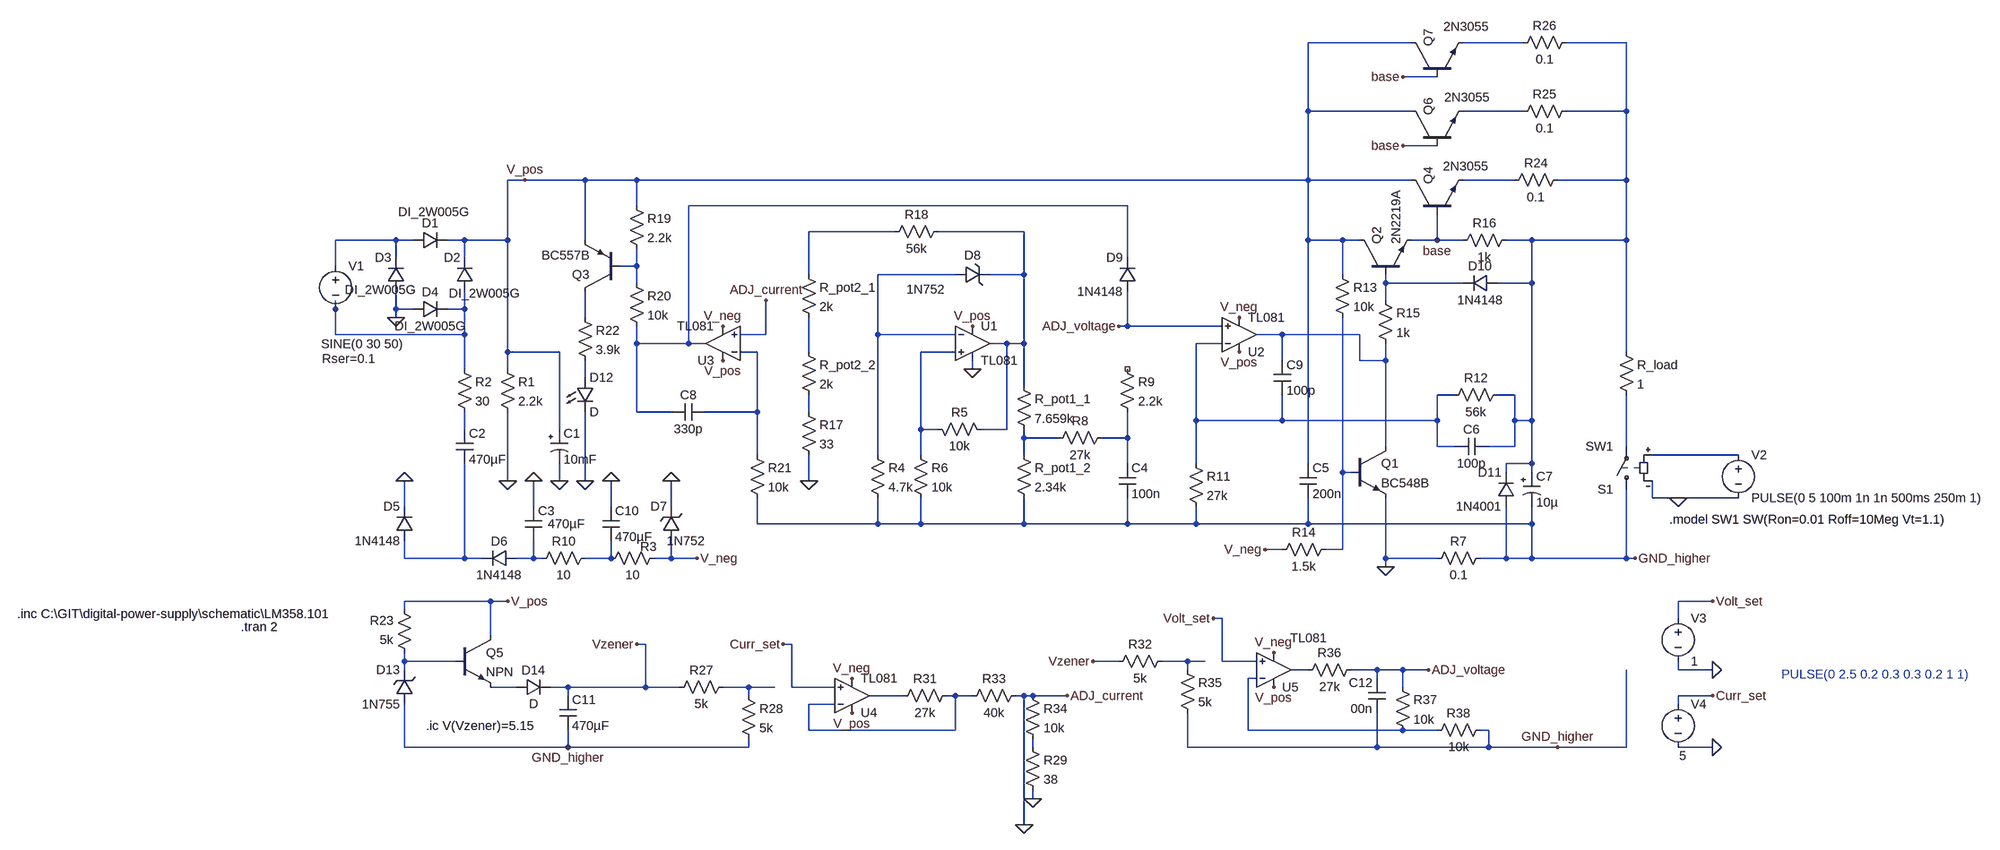
[diagram p0: schematic cccv_psu_v2.asc]
cccv_psu_v2.asc, the LTspice schematic file:
Version 4
SHEET 1 3300 1276
WIRE 2016 -256 1824 -256
WIRE 2224 -256 2112 -256
WIRE 2416 -256 2304 -256
WIRE 2064 -192 2000 -192
WIRE 1824 -128 1824 -256
WIRE 2016 -128 1824 -128
WIRE 2224 -128 2112 -128
WIRE 2416 -128 2416 -256
WIRE 2416 -128 2304 -128
WIRE 2064 -64 2000 -64
WIRE 368 0 336 0
WIRE 480 0 368 0
WIRE 576 0 480 0
WIRE 1824 0 1824 -128
WIRE 1824 0 576 0
WIRE 2016 0 1824 0
WIRE 2208 0 2112 0
WIRE 2416 0 2416 -128
WIRE 2416 0 2288 0
WIRE 576 48 576 0
WIRE 1488 48 672 48
WIRE 1056 96 896 96
WIRE 1296 96 1136 96
WIRE 128 112 16 112
WIRE 160 112 128 112
WIRE 256 112 224 112
WIRE 336 112 336 0
WIRE 336 112 256 112
WIRE 480 112 480 0
WIRE 1824 112 1824 0
WIRE 1888 112 1824 112
WIRE 1920 112 1888 112
WIRE 2064 112 2064 64
WIRE 2064 112 2016 112
WIRE 2112 112 2064 112
WIRE 2240 112 2192 112
WIRE 2416 112 2416 0
WIRE 2416 112 2240 112
WIRE 128 144 128 112
WIRE 256 144 256 112
WIRE 1488 144 1488 48
WIRE 16 160 16 112
WIRE 576 160 576 128
WIRE 576 160 544 160
WIRE 896 176 896 96
WIRE 1168 176 1024 176
WIRE 1296 176 1296 96
WIRE 1296 176 1232 176
WIRE 1888 176 1888 112
WIRE 576 192 576 160
WIRE 1968 192 1968 176
WIRE 2112 192 1968 192
WIRE 2240 192 2240 112
WIRE 2240 192 2176 192
WIRE 1968 224 1968 192
WIRE 16 240 16 224
WIRE 128 240 128 208
WIRE 160 240 128 240
WIRE 256 240 256 208
WIRE 256 240 224 240
WIRE 128 256 128 240
WIRE 480 256 480 208
WIRE 1488 272 1488 208
WIRE 1488 272 1472 272
WIRE 1664 272 1488 272
WIRE 16 288 16 240
WIRE 256 288 256 240
WIRE 256 288 16 288
WIRE 816 288 816 224
WIRE 816 288 768 288
WIRE 1024 288 1024 176
WIRE 1168 288 1024 288
WIRE 1776 288 1728 288
WIRE 1920 288 1776 288
WIRE 576 304 576 272
WIRE 672 304 672 48
WIRE 672 304 576 304
WIRE 704 304 672 304
WIRE 1264 304 1232 304
WIRE 1296 304 1296 176
WIRE 1296 304 1264 304
WIRE 1664 304 1616 304
WIRE 336 320 336 112
WIRE 432 320 336 320
WIRE 800 320 768 320
WIRE 896 320 896 256
WIRE 1168 320 1104 320
WIRE 2416 320 2416 112
WIRE 1776 336 1776 288
WIRE 1920 336 1920 288
WIRE 1968 336 1968 304
WIRE 1968 336 1920 336
WIRE 256 352 256 288
WIRE 336 352 336 320
WIRE 1200 352 1200 336
WIRE 480 368 480 336
WIRE 1296 384 1296 304
WIRE 2096 400 2064 400
WIRE 2208 400 2176 400
WIRE 576 432 576 304
WIRE 640 432 576 432
WIRE 800 432 800 320
WIRE 800 432 704 432
WIRE 896 432 896 400
WIRE 1616 448 1616 304
WIRE 1776 448 1776 400
WIRE 1776 448 1616 448
WIRE 2064 448 2064 400
WIRE 2064 448 1776 448
WIRE 2208 448 2208 400
WIRE 2240 448 2240 192
WIRE 2240 448 2208 448
WIRE 256 464 256 432
WIRE 432 464 432 320
WIRE 1104 464 1104 320
WIRE 1136 464 1104 464
WIRE 1264 464 1264 304
WIRE 1264 464 1216 464
WIRE 1296 480 1296 464
WIRE 1360 480 1296 480
WIRE 1488 480 1488 432
WIRE 1488 480 1440 480
WIRE 1968 496 1968 336
WIRE 2064 496 2064 448
WIRE 2096 496 2064 496
WIRE 2208 496 2208 448
WIRE 2208 496 2160 496
WIRE 2416 496 2416 400
WIRE 800 512 800 432
WIRE 1024 512 1024 288
WIRE 1104 512 1104 464
WIRE 1296 512 1296 480
WIRE 2624 512 2464 512
WIRE 1488 528 1488 480
WIRE 1616 528 1616 448
WIRE 1824 528 1824 112
WIRE 2240 528 2240 448
WIRE 2240 528 2192 528
WIRE 1888 544 1888 256
WIRE 1904 544 1888 544
WIRE 2192 544 2192 528
WIRE 2240 544 2240 528
WIRE 336 560 336 432
WIRE 432 560 432 528
WIRE 480 560 480 432
WIRE 896 560 896 512
WIRE 2464 592 2464 560
WIRE 2512 592 2464 592
WIRE 2624 592 2512 592
WIRE 144 608 144 560
WIRE 384 608 384 560
WIRE 528 608 528 560
WIRE 640 608 640 560
WIRE 800 640 800 592
WIRE 1024 640 1024 592
WIRE 1024 640 800 640
WIRE 1104 640 1104 592
WIRE 1104 640 1024 640
WIRE 1296 640 1296 592
WIRE 1296 640 1104 640
WIRE 1488 640 1488 592
WIRE 1488 640 1296 640
WIRE 1616 640 1616 608
WIRE 1616 640 1488 640
WIRE 1824 640 1824 592
WIRE 1824 640 1616 640
WIRE 2240 640 2240 608
WIRE 2240 640 1824 640
WIRE 1776 688 1744 688
WIRE 1888 688 1888 544
WIRE 1888 688 1856 688
WIRE 144 704 144 672
WIRE 256 704 256 528
WIRE 256 704 144 704
WIRE 288 704 256 704
WIRE 384 704 384 672
WIRE 384 704 352 704
WIRE 400 704 384 704
WIRE 528 704 528 672
WIRE 528 704 480 704
WIRE 640 704 640 672
WIRE 640 704 608 704
WIRE 688 704 640 704
WIRE 1968 704 1968 592
WIRE 2064 704 1968 704
WIRE 2192 704 2192 608
WIRE 2192 704 2144 704
WIRE 2240 704 2240 640
WIRE 2240 704 2192 704
WIRE 2416 704 2416 576
WIRE 2416 704 2240 704
WIRE 2432 704 2416 704
WIRE 1968 720 1968 704
WIRE 304 784 144 784
WIRE 336 784 304 784
WIRE 2576 784 2512 784
WIRE 144 800 144 784
WIRE 1664 816 1648 816
WIRE 2512 816 2512 784
WIRE 304 848 304 784
WIRE 592 864 576 864
WIRE 864 864 848 864
WIRE 144 896 144 880
WIRE 240 896 144 896
WIRE 1472 896 1424 896
WIRE 1600 896 1552 896
WIRE 1632 896 1600 896
WIRE 1664 896 1664 816
WIRE 1728 896 1664 896
WIRE 144 912 144 896
WIRE 1600 912 1600 896
WIRE 1824 912 1792 912
WIRE 1952 912 1904 912
WIRE 2000 912 1952 912
WIRE 2048 912 2000 912
WIRE 2512 912 2512 896
WIRE 2576 912 2512 912
WIRE 1728 928 1712 928
WIRE 1952 928 1952 912
WIRE 352 944 304 944
WIRE 448 944 416 944
WIRE 592 944 592 864
WIRE 592 944 448 944
WIRE 656 944 592 944
WIRE 784 944 736 944
WIRE 832 944 784 944
WIRE 864 944 864 864
WIRE 944 944 864 944
WIRE 2000 944 2000 912
WIRE 448 960 448 944
WIRE 784 960 784 944
WIRE 1072 960 1008 960
WIRE 1168 960 1152 960
WIRE 1200 960 1168 960
WIRE 1296 960 1280 960
WIRE 1312 960 1296 960
WIRE 1376 960 1312 960
WIRE 2576 960 2512 960
WIRE 944 976 896 976
WIRE 2512 976 2512 960
WIRE 896 1024 896 976
WIRE 1168 1024 1168 960
WIRE 1168 1024 896 1024
WIRE 1712 1024 1712 928
WIRE 2000 1024 1712 1024
WIRE 2064 1024 2000 1024
WIRE 2160 1024 2144 1024
WIRE 144 1056 144 976
WIRE 448 1056 448 1024
WIRE 448 1056 144 1056
WIRE 784 1056 784 1040
WIRE 784 1056 448 1056
WIRE 1312 1056 1312 1040
WIRE 1600 1056 1600 992
WIRE 1952 1056 1952 992
WIRE 1952 1056 1600 1056
WIRE 2160 1056 2160 1024
WIRE 2160 1056 1952 1056
WIRE 2288 1056 2160 1056
WIRE 2416 1056 2416 912
WIRE 2416 1056 2288 1056
WIRE 2576 1056 2512 1056
WIRE 1312 1152 1312 1136
WIRE 1296 1200 1296 960
FLAG 128 256 0
FLAG 336 560 0
FLAG 144 560 0
FLAG 432 560 0
FLAG 384 560 0
FLAG 640 560 0
FLAG 480 560 0
FLAG 368 0 V_pos
FLAG 736 336 V_pos
FLAG 736 272 V_neg
FLAG 1200 272 V_pos
FLAG 896 560 0
FLAG 688 704 V_neg
FLAG 1696 256 V_neg
FLAG 1696 320 V_pos
FLAG 1744 688 V_neg
FLAG 2512 592 0
FLAG 1200 352 0
FLAG 528 560 0
FLAG 1968 720 0
FLAG 336 784 V_pos
FLAG 2064 112 base
FLAG 2000 -64 base
FLAG 2000 -192 base
FLAG 816 224 ADJ_current
FLAG 1472 272 ADJ_voltage
FLAG 576 864 Vzener
FLAG 1376 960 ADJ_current
FLAG 976 992 V_pos
FLAG 1424 896 Vzener
FLAG 2048 912 ADJ_voltage
FLAG 1760 944 V_pos
FLAG 976 928 V_neg
FLAG 1760 880 V_neg
FLAG 2432 704 GND_higher
FLAG 2288 1056 GND_higher
FLAG 2576 784 Volt_set
FLAG 2576 960 Curr_set
FLAG 1648 816 Volt_set
FLAG 848 864 Curr_set
FLAG 2576 1056 0
FLAG 448 1056 GND_higher
FLAG 2576 912 0
FLAG 1312 1152 0
FLAG 1296 1200 0
SYMBOL diode 144 208 R180
WINDOW 0 24 64 Left 2
WINDOW 3 -22 4 Left 2
SYMATTR InstName D3
SYMATTR Value DI_2W005G
SYMBOL diode 160 128 R270
WINDOW 0 32 32 VTop 2
WINDOW 3 84 39 VBottom 2
SYMATTR InstName D1
SYMATTR Value DI_2W005G
SYMBOL diode 272 208 R180
WINDOW 0 24 64 Left 2
WINDOW 3 -87 -3 Left 2
SYMATTR InstName D2
SYMATTR Value DI_2W005G
SYMBOL diode 160 224 M90
WINDOW 0 0 32 VBottom 2
WINDOW 3 32 32 VTop 2
SYMATTR InstName D4
SYMATTR Value DI_2W005G
SYMBOL voltage 16 144 R0
WINDOW 3 -27 161 Left 2
WINDOW 123 0 0 Left 2
WINDOW 39 -25 189 Left 2
SYMATTR Value SINE(0 30 50)
SYMATTR SpiceLine Rser=0.1
SYMATTR InstName V1
SYMBOL res 240 336 R0
SYMATTR InstName R2
SYMATTR Value 30
SYMATTR SpiceLine pwr=.25
SYMBOL res 320 336 R0
SYMATTR InstName R1
SYMATTR Value 2.2k
SYMATTR SpiceLine pwr=1
SYMBOL diode 160 672 R180
WINDOW 0 24 64 Left 2
WINDOW 3 24 0 Left 2
SYMATTR InstName D5
SYMATTR Value 1N4148
SYMBOL diode 352 688 R90
WINDOW 0 0 32 VBottom 2
WINDOW 3 32 32 VTop 2
SYMATTR InstName D6
SYMATTR Value 1N4148
SYMBOL polcap 416 464 R0
WINDOW 3 24 56 Left 2
SYMATTR Value 10mF
SYMATTR InstName C1
SYMATTR Description Capacitor
SYMATTR Type cap
SYMATTR SpiceLine V=50 Irms=1.95 Rser=0.028 Lser=0
SYMBOL res 624 688 R90
WINDOW 0 10 26 VBottom 2
WINDOW 3 32 56 VTop 2
SYMATTR InstName R3
SYMATTR Value 10
SYMATTR SpiceLine pwr=.25
SYMBOL LED 464 368 R0
SYMATTR InstName D12
SYMBOL res 464 240 R0
SYMATTR InstName R22
SYMATTR Value 3.9k
SYMATTR SpiceLine pwr=.25
SYMBOL pnp 544 208 R180
SYMATTR InstName Q3
SYMATTR Value BC557B
SYMBOL res 560 32 R0
SYMATTR InstName R19
SYMATTR Value 2.2k
SYMATTR SpiceLine pwr=.25
SYMBOL res 560 176 R0
SYMATTR InstName R20
SYMATTR Value 10k
SYMATTR SpiceLine pwr=.25
SYMBOL cap 640 448 R270
WINDOW 0 32 32 VTop 2
WINDOW 3 0 32 VBottom 2
SYMATTR InstName C8
SYMATTR Value 330p
SYMBOL res 784 496 R0
SYMATTR InstName R21
SYMATTR Value 10k
SYMATTR SpiceLine pwr=.25
SYMBOL res 880 160 R0
SYMATTR InstName R_pot2_1
SYMATTR Value 2k
SYMBOL res 880 304 R0
SYMATTR InstName R_pot2_2
SYMATTR Value 2k
SYMBOL res 880 416 R0
SYMATTR InstName R17
SYMATTR Value 33
SYMATTR SpiceLine pwr=.25
SYMBOL res 1008 496 R0
SYMATTR InstName R4
SYMATTR Value 4.7k
SYMATTR SpiceLine pwr=.25
SYMBOL res 1088 496 R0
SYMATTR InstName R6
SYMATTR Value 10k
SYMATTR SpiceLine pwr=.25
SYMBOL res 1152 80 R90
WINDOW 0 0 56 VBottom 2
WINDOW 3 32 56 VTop 2
SYMATTR InstName R18
SYMATTR Value 56k
SYMATTR SpiceLine pwr=.25
SYMBOL zener 1168 192 R270
WINDOW 0 36 32 VTop 2
WINDOW 3 4 -55 VBottom 2
SYMATTR InstName D8
SYMATTR Value 1N752
SYMBOL zener 656 672 R180
WINDOW 0 24 64 Left 2
WINDOW 3 -47 0 Left 2
SYMATTR InstName D7
SYMATTR Value 1N752
SYMBOL res 1232 480 M270
WINDOW 0 32 56 VTop 2
WINDOW 3 0 56 VBottom 2
SYMATTR InstName R5
SYMATTR Value 10k
SYMATTR SpiceLine pwr=.25
SYMBOL res 1280 496 R0
SYMATTR InstName R_pot1_2
SYMATTR Value 2.34k
SYMATTR SpiceLine pwr=.25
SYMBOL res 1280 368 R0
SYMATTR InstName R_pot1_1
SYMATTR Value 7.659k
SYMATTR SpiceLine pwr=.25
SYMBOL res 1344 496 R270
WINDOW 0 32 56 VTop 2
WINDOW 3 0 56 VBottom 2
SYMATTR InstName R8
SYMATTR Value 27k
SYMATTR SpiceLine pwr=.25
SYMBOL cap 1472 528 R0
SYMATTR InstName C4
SYMATTR Value 100n
SYMBOL res 1472 336 R0
SYMATTR InstName R9
SYMATTR Value 2.2k
SYMATTR SpiceLine pwr=.25
SYMBOL diode 1504 208 R180
WINDOW 0 24 64 Left 2
WINDOW 3 24 0 Left 2
SYMATTR InstName D9
SYMATTR Value 1N4148
SYMBOL res 1600 512 R0
SYMATTR InstName R11
SYMATTR Value 27k
SYMATTR SpiceLine pwr=.25
SYMBOL cap 1760 336 R0
SYMATTR InstName C9
SYMATTR Value 100p
SYMBOL npn 2016 64 R270
WINDOW 3 90 59 VRight 2
SYMATTR Value 2N3055
SYMATTR InstName Q4
SYMBOL npn 1920 176 R270
SYMATTR InstName Q2
SYMATTR Value 2N2219A
SYMBOL res 2208 96 R90
WINDOW 0 0 56 VBottom 2
WINDOW 3 32 56 VTop 2
SYMATTR InstName R16
SYMATTR Value 1k
SYMATTR SpiceLine pwr=.25
SYMBOL res 1872 160 R0
SYMATTR InstName R13
SYMATTR Value 10k
SYMATTR SpiceLine pwr=.25
SYMBOL res 1952 208 R0
SYMATTR InstName R15
SYMATTR Value 1k
SYMATTR SpiceLine pwr=.25
SYMBOL diode 2176 176 R90
WINDOW 0 0 32 VBottom 2
WINDOW 3 32 32 VTop 2
SYMATTR InstName D10
SYMATTR Value 1N4148
SYMBOL cap 1808 528 R0
SYMATTR InstName C5
SYMATTR Value 200n
SYMBOL res 2080 416 R270
WINDOW 0 32 56 VTop 2
WINDOW 3 0 56 VBottom 2
SYMATTR InstName R12
SYMATTR Value 56k
SYMATTR SpiceLine pwr=.25
SYMBOL cap 2160 480 R90
WINDOW 0 0 32 VBottom 2
WINDOW 3 32 32 VTop 2
SYMATTR InstName C6
SYMATTR Value 100p
SYMBOL polcap 2224 544 R0
WINDOW 3 24 56 Left 2
SYMATTR Value 10µ
SYMATTR InstName C7
SYMATTR Description Capacitor
SYMATTR Type cap
SYMATTR SpiceLine V=50 Irms=170m Rser=1 Lser=0 mfg="Nichicon" pn="UPG1H100MPH" type="Al electrolytic"
SYMBOL diode 2208 608 R180
WINDOW 0 24 64 Left 2
WINDOW 3 24 0 Left 2
SYMATTR InstName D11
SYMATTR Value 1N4001
SYMBOL res 2160 688 R90
WINDOW 0 0 56 VBottom 2
WINDOW 3 32 56 VTop 2
SYMATTR InstName R7
SYMATTR Value 0.1
SYMATTR SpiceLine pwr=5
SYMBOL npn 1904 496 R0
SYMATTR InstName Q1
SYMATTR Value BC548B
SYMBOL res 1872 672 R90
WINDOW 0 0 56 VBottom 2
WINDOW 3 32 56 VTop 2
SYMATTR InstName R14
SYMATTR Value 1.5k
SYMATTR SpiceLine pwr=.25
SYMBOL res 2400 304 R0
SYMATTR InstName R_load
SYMATTR Value 1
SYMBOL Opamps\\opamp2 1200 240 R0
SYMATTR InstName U1
SYMATTR Value TL081
SYMBOL Opamps\\opamp2 736 368 R180
SYMATTR InstName U3
SYMATTR Value TL081
SYMBOL Opamps\\opamp2 1696 352 M180
SYMATTR InstName U2
SYMATTR Value TL081
SYMBOL sw 2416 592 R180
SYMATTR InstName S1
SYMATTR Value SW1
SYMBOL voltage 2624 496 R0
WINDOW 123 0 0 Left 2
WINDOW 39 0 0 Left 2
SYMATTR InstName V2
SYMATTR Value PULSE(0 5 100m 1n 1n 500ms 250m 1)
SYMBOL cap 240 464 R0
SYMATTR InstName C2
SYMATTR Value 470µF
SYMBOL cap 368 608 R0
WINDOW 3 43 32 Left 2
SYMATTR Value 470µF
SYMATTR InstName C3
SYMBOL res 496 688 R90
WINDOW 0 0 56 VBottom 2
WINDOW 3 32 56 VTop 2
SYMATTR InstName R10
SYMATTR Value 10
SYMBOL cap 512 608 R0
SYMATTR InstName C10
SYMATTR Value 470µF
SYMBOL zener 160 976 R180
WINDOW 0 24 64 Left 2
WINDOW 3 24 0 Left 2
SYMATTR InstName D13
SYMATTR Value 1N755
SYMBOL res 160 896 R180
WINDOW 0 36 76 Left 2
WINDOW 3 36 40 Left 2
SYMATTR InstName R23
SYMATTR Value 5k
SYMBOL npn 240 848 R0
SYMATTR InstName Q5
SYMBOL diode 352 960 R270
WINDOW 0 32 32 VTop 2
WINDOW 3 0 32 VBottom 2
SYMATTR InstName D14
SYMBOL cap 432 960 R0
SYMATTR InstName C11
SYMATTR Value 470µF
SYMBOL npn 2016 -64 R270
WINDOW 3 90 61 VRight 2
SYMATTR Value 2N3055
SYMATTR InstName Q6
SYMBOL npn 2016 -192 R270
WINDOW 3 94 60 VRight 2
SYMATTR Value 2N3055
SYMATTR InstName Q7
SYMBOL res 2304 -16 R90
WINDOW 0 0 56 VBottom 2
WINDOW 3 32 56 VTop 2
SYMATTR InstName R24
SYMATTR Value 0.1
SYMATTR SpiceLine tol=10%
SYMBOL res 2320 -144 R90
WINDOW 0 0 56 VBottom 2
WINDOW 3 32 56 VTop 2
SYMATTR InstName R25
SYMATTR Value 0.1
SYMATTR SpiceLine tol=10%
SYMBOL res 2320 -272 R90
WINDOW 0 0 56 VBottom 2
WINDOW 3 32 56 VTop 2
SYMATTR InstName R26
SYMATTR Value 0.1
SYMATTR SpiceLine tol=10%
SYMBOL res 752 928 R90
WINDOW 0 0 56 VBottom 2
WINDOW 3 32 56 VTop 2
SYMATTR InstName R27
SYMATTR Value 5k
SYMBOL res 768 944 R0
SYMATTR InstName R28
SYMATTR Value 5k
SYMBOL res 1168 944 R90
WINDOW 0 0 56 VBottom 2
WINDOW 3 32 56 VTop 2
SYMATTR InstName R31
SYMATTR Value 27k
SYMBOL Opamps\\opamp2 976 1024 M180
SYMATTR InstName U4
SYMATTR Value TL081
SYMBOL res 1184 976 R270
WINDOW 0 32 56 VTop 2
WINDOW 3 0 56 VBottom 2
SYMATTR InstName R33
SYMATTR Value 40k
SYMBOL res 1296 944 R0
SYMATTR InstName R34
SYMATTR Value 10k
SYMBOL res 1456 912 R270
WINDOW 0 32 56 VTop 2
WINDOW 3 0 56 VBottom 2
SYMATTR InstName R32
SYMATTR Value 5k
SYMBOL res 1584 896 R0
SYMATTR InstName R35
SYMATTR Value 5k
SYMBOL res 1920 896 R90
WINDOW 0 0 56 VBottom 2
WINDOW 3 32 56 VTop 2
SYMATTR InstName R36
SYMATTR Value 27k
SYMBOL Opamps\\opamp2 1760 976 M180
WINDOW 3 31 123 Left 2
SYMATTR InstName U5
SYMATTR Value TL081
SYMBOL res 1984 928 R0
SYMATTR InstName R37
SYMATTR Value 10k
SYMBOL res 2160 1008 R90
WINDOW 0 0 56 VBottom 2
WINDOW 3 32 56 VTop 2
SYMATTR InstName R38
SYMATTR Value 10k
SYMBOL voltage 2512 800 R0
WINDOW 123 0 0 Left 2
WINDOW 39 0 0 Left 2
SYMATTR InstName V3
SYMATTR Value 1
SYMBOL voltage 2512 960 R0
WINDOW 3 2 112 Left 2
WINDOW 123 0 0 Left 2
WINDOW 39 0 0 Left 2
SYMATTR InstName V4
SYMATTR Value 5
SYMBOL cap 1968 992 R180
WINDOW 0 24 56 Left 2
WINDOW 3 24 8 Left 2
SYMATTR InstName C12
SYMATTR Value 00n
SYMBOL res 1296 1040 R0
SYMATTR InstName R29
SYMATTR Value 38
TEXT -160 832 Left 2 !.tran 2
TEXT -576 808 Left 2 !.inc C:\\GIT\\digital-power-supply\\schematic\\LM358.101
TEXT 2496 632 Left 2 !.model SW1 SW(Ron=0.01 Roff=10Meg Vt=1.1)
TEXT 184 1016 Left 2 !.ic V(Vzener)=5.15
TEXT 2704 920 Left 2 ;PULSE(0 2.5 0.2 0.3 0.3 0.2 1 1)

The netlist it stands for:
* cccv_psu_v2.asc
D3 0 N008 DI_2W005G
D1 N008 V_pos DI_2W005G
D2 N012 V_pos DI_2W005G
D4 0 N012 DI_2W005G
V1 N008 N012 SINE(0 30 50) Rser=0.1
R2 N012 N021 30 pwr=.25
R1 V_pos 0 2.2k pwr=1
D5 N027 0 1N4148
D6 N028 N027 1N4148
C1 V_pos 0 10mF V=50 Irms=1.95 Rser=0.028 Lser=0
R3 V_neg N029 10 pwr=.25
D12 N019 0 D
R22 N013 N019 3.9k pwr=.25
Q3 N013 N009 V_pos 0 BC557B
R19 V_pos N009 2.2k pwr=.25
R20 N009 N005 10k pwr=.25
C8 N005 N016 330p
R21 N016 GND_higher 10k pwr=.25
R_pot2_1 N006 N017 2k
R_pot2_2 N017 N020 2k
R17 N020 0 33 pwr=.25
R4 N010 GND_higher 4.7k pwr=.25
R6 N018 GND_higher 10k pwr=.25
R18 N007 N006 56k pwr=.25
D8 N010 N007 1N752
D7 V_neg 0 1N752
R5 N007 N018 10k pwr=.25
R_pot1_2 N022 GND_higher 2.34k pwr=.25
R_pot1_1 N007 N022 7.659k pwr=.25
R8 N022 N023 27k pwr=.25
C4 N023 GND_higher 100n
R9 NC_01 N023 2.2k pwr=.25
D9 ADJ_voltage N005 1N4148
R11 N015 GND_higher 27k pwr=.25
C9 N014 N015 100p
Q4 V_pos base N004 0 2N3055
Q2 V_pos N011 base 0 2N2219A
R16 N002 base 1k pwr=.25
R13 V_pos N026 10k pwr=.25
R15 N011 N014 1k pwr=.25
D10 N002 N011 1N4148
C5 V_pos GND_higher 200n
R12 N015 N002 56k pwr=.25
C6 N002 N015 100p
C7 N002 GND_higher 10µ V=50 Irms=170m Rser=1 Lser=0 mfg="Nichicon" pn="UPG1H100MPH" type="Al electrolytic"
D11 GND_higher N002 1N4001
R7 GND_higher 0 0.1 pwr=5
Q1 N014 N026 0 0 BC548B
R14 N026 V_neg 1.5k pwr=.25
R_load N002 N024 1
XU1 N018 N010 V_pos 0 N007 TL081  ; pins In+ In- V+ V- OUT
XU3 0 N016 V_pos V_neg N005 TL081  ; pins In+ In- V+ V- OUT
XU2 ADJ_voltage N015 V_pos V_neg N014 TL081  ; pins In+ In- V+ V- OUT
S1 GND_higher N024 N025 0 SW1
V2 N025 0 PULSE(0 5 100m 1n 1n 500ms 250m 1)
C2 N021 N027 470µF
C3 0 N028 470µF
R10 N029 N028 10
C10 0 N029 470µF
D13 GND_higher N030 1N755
R23 N030 V_pos 5k
Q5 V_pos N030 N034 0 NPN
D14 N034 Vzener D
C11 Vzener GND_higher 470µF
Q6 V_pos base N003 0 2N3055
Q7 V_pos base N001 0 2N3055
R24 N002 N004 0.1 tol=10%
R25 N002 N003 0.1 tol=10%
R26 N002 N001 0.1 tol=10%
R27 N035 Vzener 5k
R28 N035 GND_higher 5k
R31 N037 N036 27k
XU4 Curr_set N037 V_pos V_neg N036 TL081  ; pins In+ In- V+ V- OUT
R33 N037 0 40k
R34 0 N038 10k
R32 Vzener N031 5k
R35 N031 GND_higher 5k
R36 ADJ_voltage N032 27k
XU5 Volt_set N033 V_pos V_neg N032 TL081  ; pins In+ In- V+ V- OUT
R37 ADJ_voltage N033 10k
R38 GND_higher N033 10k
V3 Volt_set 0 1
V4 Curr_set 0 5
C12 GND_higher ADJ_voltage 00n
R29 N038 0 38
.model D D
.lib standard.dio
.model NPN NPN
.model PNP PNP
.lib standard.bjt
.tran 2
.inc C:\GIT\digital-power-supply\schematic\LM358.101
.model SW1 SW(Ron=0.01 Roff=10Meg Vt=1.1)
.ic V(Vzener)=5.15
* PULSE(0 2.5 0.2 0.3 0.3 0.2 1 1)
.backanno
.end